# Altium schematic sheet Universal register 16bit.SchDoc
size A3; PartNumber: PNxxx; Drawn By: Me?
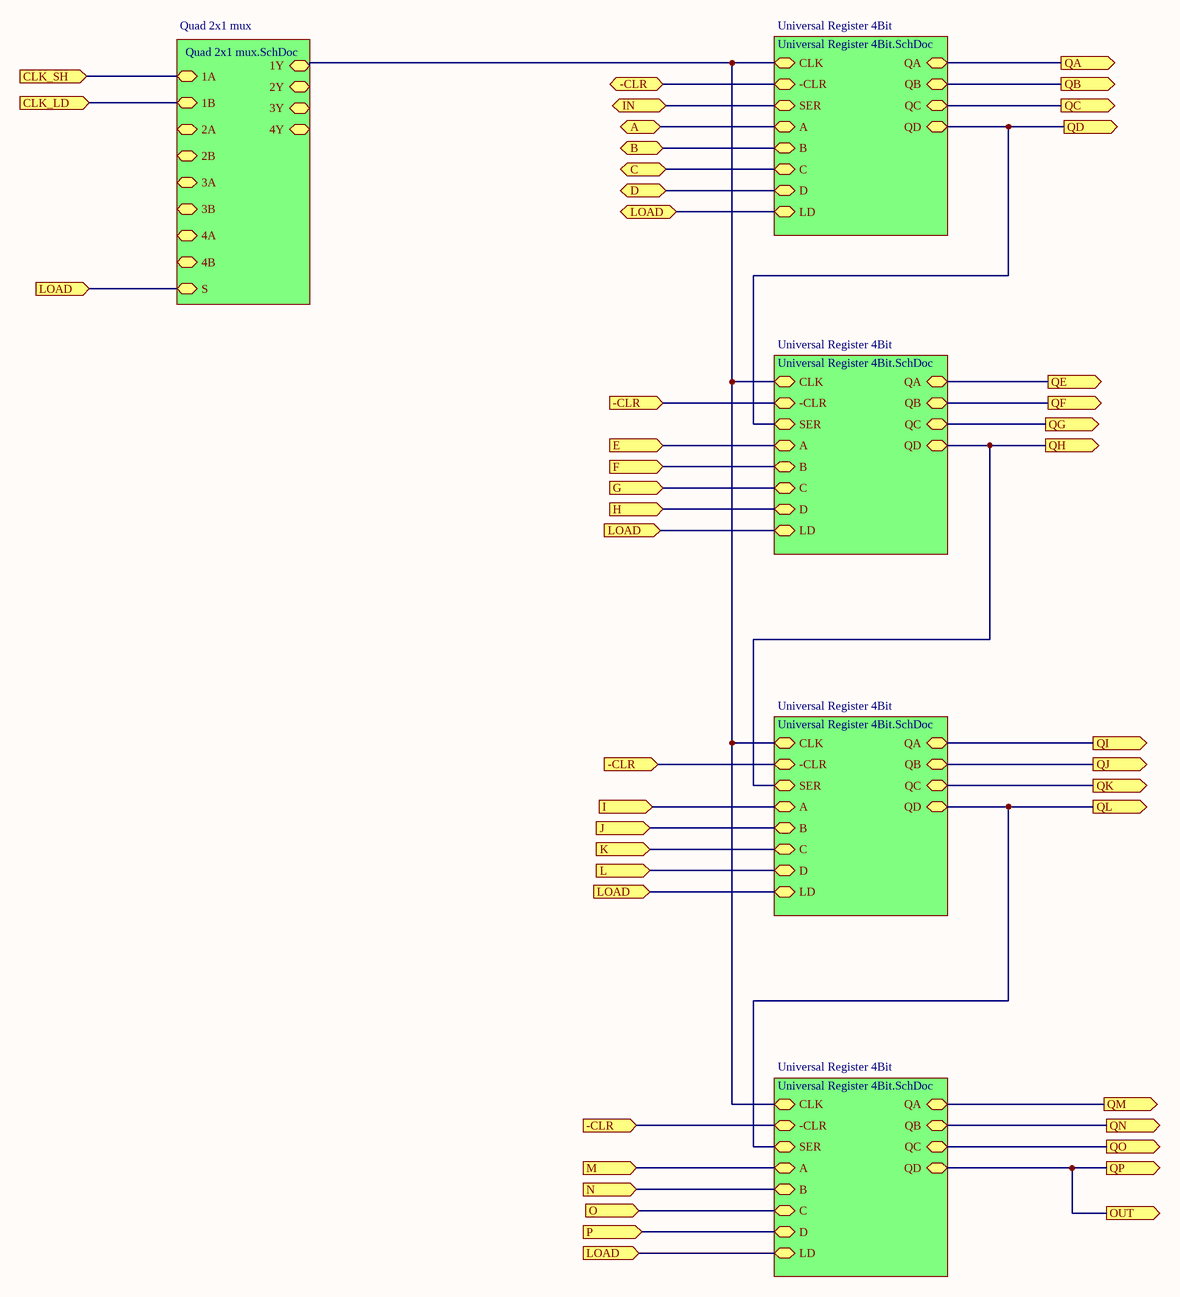
[diagram p0: Universal register 16bit.SchDoc]

## Sub-sheets
Quad 2x1 mux = Quad 2x1 mux.SchDoc: 1A, 1B, 2A, 2B, 3A, 3B, 4A, 4B, S, 1Y, 2Y, 3Y, 4Y
Universal Register 4Bit = Universal Register 4Bit.SchDoc: CLK, -CLR, SER, A, B, C, D, LD, QA, QB, QC, QD
Universal Register 4Bit = Universal Register 4Bit.SchDoc: CLK, -CLR, SER, A, B, C, D, LD, QA, QB, QC, QD
Universal Register 4Bit = Universal Register 4Bit.SchDoc: CLK, -CLR, SER, A, B, C, D, LD, QA, QB, QC, QD
Universal Register 4Bit = Universal Register 4Bit.SchDoc: CLK, -CLR, SER, A, B, C, D, LD, QA, QB, QC, QD

## Ports
-CLR (bidir), -CLR (in), A (bidir), B (bidir), C (bidir), CLK_LD (in), CLK_SH (in), D (bidir), E (in), F (in), G (in), H (in), I (in), IN (bidir), J (in), K (in), L (in), LOAD (bidir), LOAD (in), M (in), N (in), O (in), OUT (out), P (in), QA (out), QB (out), QC (out), QD (out), QE (out), QF (out), QG (out), QH (out), QI (out), QJ (out), QK (out), QL (out), QM (out), QN (out), QO (out), QP (out)

## Nets
-CLR: port -CLR, sheet Universal Register 4Bit/-CLR, sheet Universal Register 4Bit/-CLR, sheet Universal Register 4Bit/-CLR, sheet Universal Register 4Bit/-CLR
A: port A, sheet Universal Register 4Bit/A
B: port B, sheet Universal Register 4Bit/B
C: port C, sheet Universal Register 4Bit/C
CLK_LD: port CLK_LD, sheet Quad 2x1 mux/1B
CLK_SH: port CLK_SH, sheet Quad 2x1 mux/1A
D: port D, sheet Universal Register 4Bit/D
E: port E, sheet Universal Register 4Bit/A
F: port F, sheet Universal Register 4Bit/B
G: port G, sheet Universal Register 4Bit/C
H: port H, sheet Universal Register 4Bit/D
I: port I, sheet Universal Register 4Bit/A
IN: port IN, sheet Universal Register 4Bit/SER
J: port J, sheet Universal Register 4Bit/B
K: port K, sheet Universal Register 4Bit/C
L: port L, sheet Universal Register 4Bit/D
LOAD: port LOAD, sheet Universal Register 4Bit/LD, sheet Quad 2x1 mux/S, sheet Universal Register 4Bit/LD, sheet Universal Register 4Bit/LD, sheet Universal Register 4Bit/LD
M: port M, sheet Universal Register 4Bit/A
N: port N, sheet Universal Register 4Bit/B
O: port O, sheet Universal Register 4Bit/C
OUT: port QP, port OUT, sheet Universal Register 4Bit/QD
P: port P, sheet Universal Register 4Bit/D
QA: port QA, sheet Universal Register 4Bit/QA
QB: port QB, sheet Universal Register 4Bit/QB
QC: port QC, sheet Universal Register 4Bit/QC
QD: port QD, sheet Universal Register 4Bit/QD, sheet Universal Register 4Bit/SER
QE: port QE, sheet Universal Register 4Bit/QA
QF: port QF, sheet Universal Register 4Bit/QB
QG: port QG, sheet Universal Register 4Bit/QC
QH: port QH, sheet Universal Register 4Bit/QD, sheet Universal Register 4Bit/SER
QI: port QI, sheet Universal Register 4Bit/QA
QJ: port QJ, sheet Universal Register 4Bit/QB
QK: port QK, sheet Universal Register 4Bit/QC
QL: port QL, sheet Universal Register 4Bit/QD, sheet Universal Register 4Bit/SER
QM: port QM, sheet Universal Register 4Bit/QA
QN: port QN, sheet Universal Register 4Bit/QB
QO: port QO, sheet Universal Register 4Bit/QC
(unnamed): sheet Universal Register 4Bit/CLK, sheet Quad 2x1 mux/1Y, sheet Universal Register 4Bit/CLK, sheet Universal Register 4Bit/CLK, sheet Universal Register 4Bit/CLK

## Notes on the sheet
- Title
- Date
- Part Number
- Revision
- Sheet
- of
- Drawn By
- File